# Altium schematic sheet ZMPT101.SchDoc
size A
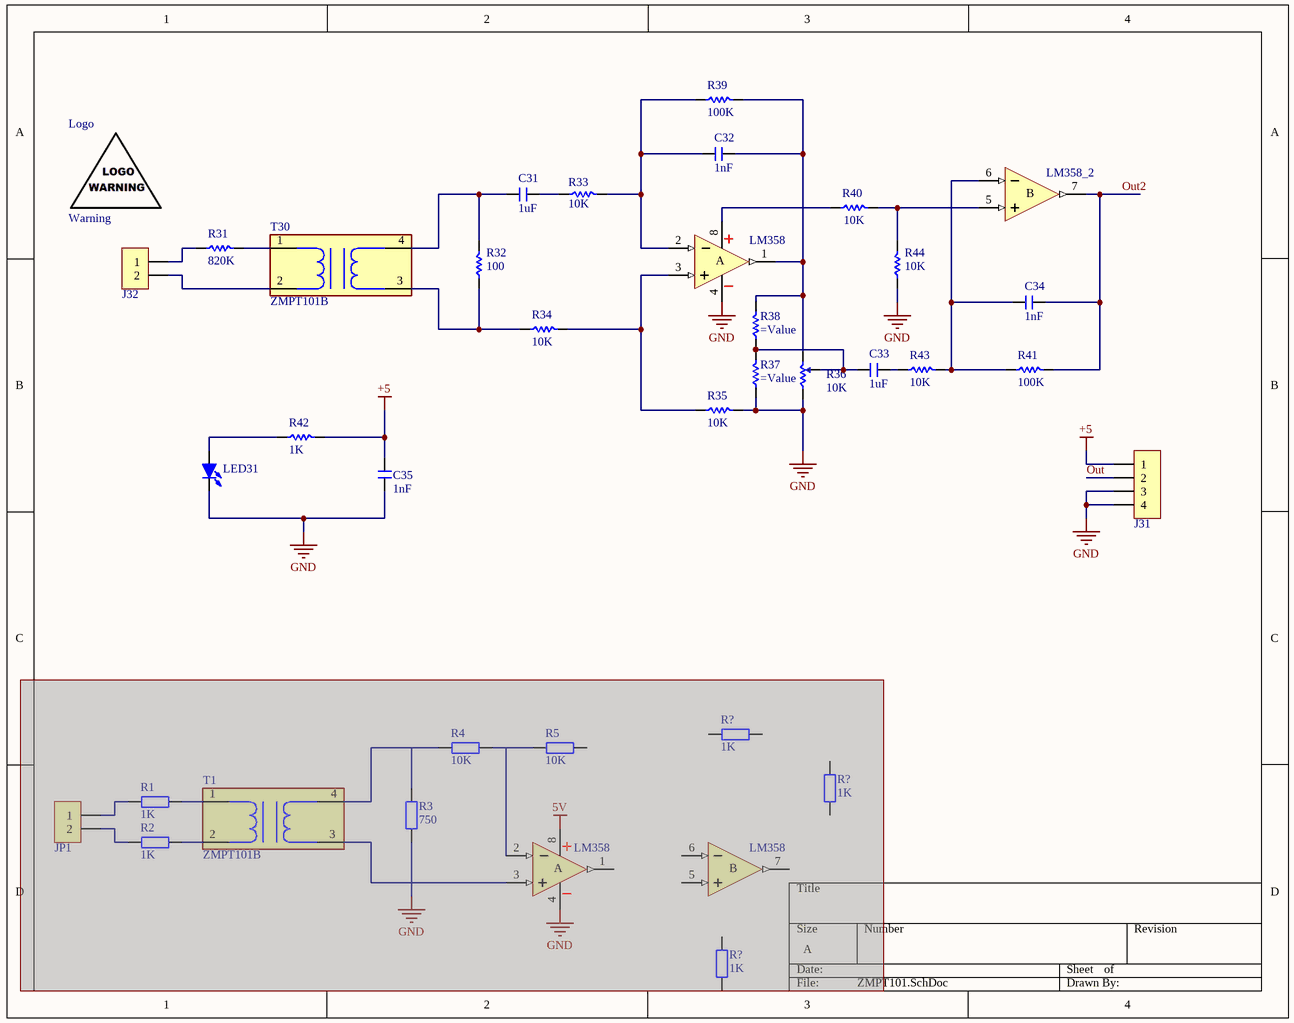
[diagram p0: ZMPT101.SchDoc]

## Parts
(Parts that share a designator on the sheet are numbered #1, #2 ... from top to bottom, then left to right.)
C31  1uF  [C 0805]
C32  1nF  [C 0805]
C33  1uF  [C 0805]
C34  1nF  [C 0805]
C35  1nF  [C 0805]
IC1#1  LM358  [SOP8_N]  (parts A,B of 2)
IC1#2  LM358  [SOP8_N]  (parts A,B of 2)  (masked out: inside a compile mask, not in the netlist)
J31  HDR-1X4  [HDR-1X4]  (value not drawn)
J32  HDR-1X2  [KF301-2P]  (value not drawn)
JP1  HDR-1X2  [KF301-2P]  (value not drawn)  (masked out: inside a compile mask, not in the netlist)
LED31  LED-SMD  [LED 0805B]  (value not drawn)
Logo  Warning  [WARNING High Voltage]
R1  1K  [R 0805]  (masked out: inside a compile mask, not in the netlist)
R2  1K  [R 0805]  (masked out: inside a compile mask, not in the netlist)
R3  750  [R 0805]  (masked out: inside a compile mask, not in the netlist)
R4  10K  [R 0805]  (masked out: inside a compile mask, not in the netlist)
R5  10K  [R 0805]  (masked out: inside a compile mask, not in the netlist)
R31  820K  [R 0805]
R32  100  [R 0805]
R33  10K  [R 0805]
R34  10K  [R 0805]
R35  10K  [R 0805]
R36  10K  [3296W]
R37  (no value)  [R 0805]
R38  (no value)  [R 0805]
R39  100K  [R 0805]
R40  10K  [R 0805]
R41  100K  [R 0805]
R42  1K  [R 0805]
R43  10K  [R 0805]
R44  10K  [R 0805]
R?#1  1K  [R 0805]  (masked out: inside a compile mask, not in the netlist)
R?#2  1K  [R 0805]  (masked out: inside a compile mask, not in the netlist)
R?#3  1K  [R 0805]  (masked out: inside a compile mask, not in the netlist)
T1  ZMPT101B  [ZMPT101B]  (masked out: inside a compile mask, not in the netlist)
T30  ZMPT101B  [ZMPT101B]

## Nets
+5: C35.2 J31.1 R42.2
GND: C35.1 IC1#1.4(VCC-) J31.3 J31.4 LED31.2(K) R35.2 R36.1 R37.1 R44.1
Out: J31.2
Out2: C34.2 IC1#1.7(OUT2) R41.2
NetC31_1: C31.1 R32.2 T30.4(SEC_2)
NetC31_2: C31.2 R33.1
NetC32_1: C32.1 IC1#1.2(IN1-) R33.2 R39.1
NetC32_2: C32.2 IC1#1.1(OUT1) R36.2 R38.2 R39.2
NetC33_1: C33.1 R36.ADJ R37.2 R38.1
NetC33_2: C33.2 R43.1
NetC34_1: C34.1 IC1#1.6(IN2-) R41.1 R43.2
NetIC1#1_3: IC1#1.3(IN1-) R34.2 R35.1
NetIC1#1_5: IC1#1.5(IN2-) R40.2 R44.2
NetIC1#1_8: IC1#1.8(VCC+) R40.1
NetJ32_1: J32.1 R31.1
NetJ32_2: J32.2 T30.2(PRI_2)
NetLED31_1: LED31.1(A) R42.1
NetR31_2: R31.2 T30.1(PRI_1)
NetR32_1: R32.1 R34.1 T30.3(SEC_1)

## Notes on the sheet
- (in symbol LM358, part A) A
- (in symbol LM358, part B) B

## Library data of the parts
C31-C35 = C: Non-polar patch capacitor; BOM名称: 无极性贴片电容; 版权归属: 源创客; 学习资源: www.ooocke.com
IC1#1 IC1#2 = LM358: Dual op amp; BOM名称: 双路运放; 版权归属: 源创客; 学习资源: www.ooocke.com
J31 = Header 4: 4P connector; BOM名称: 4P接插件; 版权归属: 源创客; 学习资源: www.ooocke.com
J32 JP1 = Header 2: 2P connector; BOM名称: 2P接插件; 版权归属: 源创客; 学习资源: www.ooocke.com
LED31 = LED-SMD: Patch LED; BOM名称: 贴片LED; 版权归属: 源创客; 学习资源: www.ooocke.com
R1-R5 R?#1-R?#3 = R: Chip resistor; BOM名称: 贴片电阻; 版权归属: 源创客; 学习资源: www.ooocke.com
R31-R35 R37-R44 = R: Chip resistor; 版权归属: 源创客; BOM名称: Chip resistor; 学习资源: www.ooocke.com
R36 = RP-THD: Plug-in potentiometer; BOM名称: 插件电位器; 版权归属: 源创客; 学习资源: www.ooocke.com
T1 T30 = ZMPT101B: Current-type Voltage Transformer; Manufacturer_Name: Qingxian Zeming Langxi Electronic; Datasheet Link: https://www.google.com/url?sa=t&rct=j&q=&esrc=s&source=web&cd=1&cad=rja&uact=8&ved=2ahUKEwimmPu3qq3kAhVbiFwKHdweBhQQFjAAegQIABAC&url=http%3A%2F%2F5nrorwxhmqqijik.leadongcdn.com%2Fattachment%2FkjilKBmoioSRqlkqjoipSR7ww7fgzb73m%2FZMPT101B-specification.pdf&; Height: 18.8mm; Manufacturer_Part_Number: ZMPT101B